# Altium schematic sheet OUTPUT SECTION.SchDoc
size A4; Organization: Altium Limited; Address1: L3, 12a Rodborough Rd; Address2: Frenchs Forest; Address3: NSW; Address4: Australia 2086
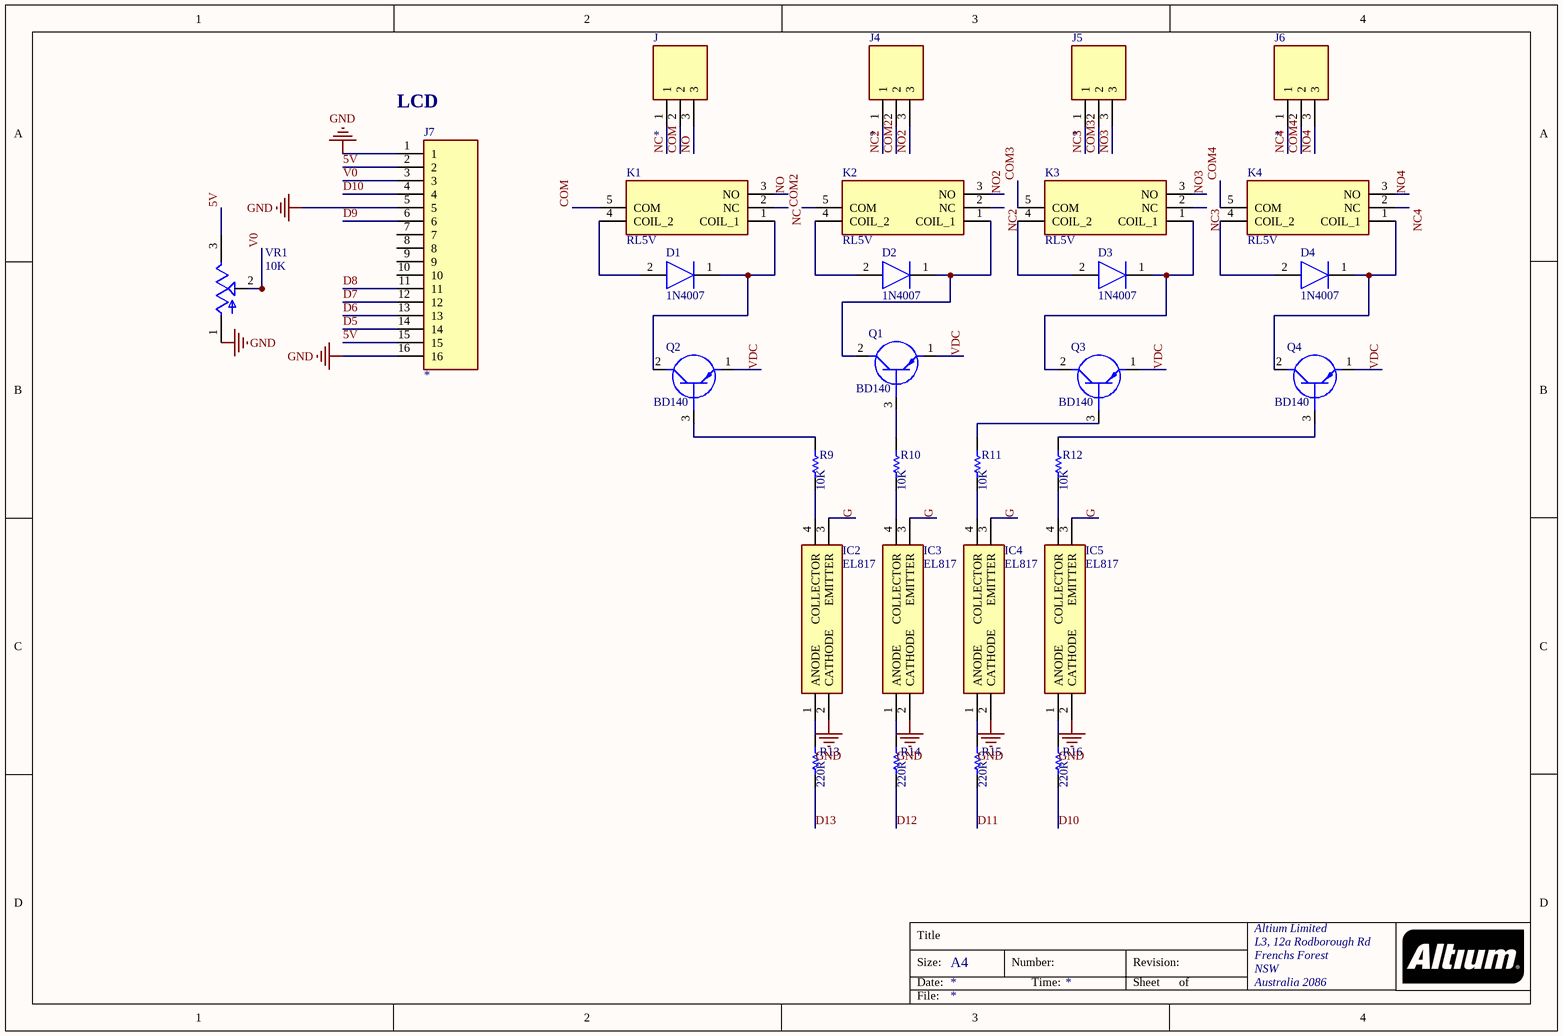
[diagram p0: OUTPUT SECTION.SchDoc]

## Parts
D1  1N4007  [DIOAD1138W56L406D183]
D2  1N4007  [DIOAD1138W56L406D183]
D3  1N4007  [DIOAD1138W56L406D183]
D4  1N4007  [DIOAD1138W56L406D183]
IC2  EL817  [DIP762W60P254L458H480Q4N]
IC3  EL817  [DIP762W60P254L458H480Q4N]
IC4  EL817  [DIP762W60P254L458H480Q4N]
IC5  EL817  [DIP762W60P254L458H480Q4N]
J  1776118-3  [TE_1776118-3]  (value not drawn)
J4  1776118-3  [TE_1776118-3]  (value not drawn)
J5  1776118-3  [TE_1776118-3]  (value not drawn)
J6  1776118-3  [TE_1776118-3]  (value not drawn)
J7  1-826646-6  [TE_1-826646-6]  (value not drawn)
K1  RL5V  [0476618]
K2  RL5V  [0476618]
K3  RL5V  [0476618]
K4  RL5V  [0476618]
Q1  BD140  [TO229P345X800X1460-3P]
Q2  BD140  [TO229P345X800X1460-3P]
Q3  BD140  [TO229P345X800X1460-3P]
Q4  BD140  [TO229P345X800X1460-3P]
R9  value 10K  [AXIAL-0.5]
R10  value 10K  [AXIAL-0.5]
R11  value 10K  [AXIAL-0.5]
R12  value 10K  [AXIAL-0.5]
R13  value 220R  [AXIAL-0.5]
R14  value 220R  [AXIAL-0.5]
R15  value 220R  [AXIAL-0.5]
R16  value 220R  [AXIAL-0.5]
VR1  10K  [TRIM_3362P-1-105]

## Nets
GND: IC2.2(CATHODE) IC3.2(CATHODE) IC4.2(CATHODE) IC5.2(CATHODE) J7.1 J7.5 J7.16 VR1.1(CCW)
5V: J7.2 J7.15 VR1.3(CW)
COM: J.2 K1.5(COM)
COM2: J4.2 K2.5(COM)
COM3: J5.2 K3.5(COM)
COM4: J6.2 K4.5(COM)
D5: J7.14
D6: J7.13
D7: J7.12
D8: J7.11
D9: J7.6
D10: J7.4 R16.1
D11: R15.1
D12: R14.1
D13: R13.1
G: IC2.3(EMITTER) IC3.3(EMITTER) IC4.3(EMITTER) IC5.3(EMITTER)
NC: J.1 K1.2(NC)
NC2: J4.1 K2.2(NC)
NC3: J5.1 K3.2(NC)
NC4: J6.1 K4.2(NC)
NO: J.3 K1.3(NO)
NO2: J4.3 K2.3(NO)
NO3: J5.3 K3.3(NO)
NO4: J6.3 K4.3(NO)
V0: J7.3 VR1.2(WIPER)
VDC: Q1.1(E) Q2.1(E) Q3.1(E) Q4.1(E)
NetD1_1: D1.1(K) K1.1(COIL_1) Q2.2(C)
NetD1_2: D1.2(A) K1.4(COIL_2)
NetD2_1: D2.1(K) K2.1(COIL_1) Q1.2(C)
NetD2_2: D2.2(A) K2.4(COIL_2)
NetD3_1: D3.1(K) K3.1(COIL_1) Q3.2(C)
NetD3_2: D3.2(A) K3.4(COIL_2)
NetD4_1: D4.1(K) K4.1(COIL_1) Q4.2(C)
NetD4_2: D4.2(A) K4.4(COIL_2)
NetIC2_1: IC2.1(ANODE) R13.2
NetIC2_4: IC2.4(COLLECTOR) R9.1
NetIC3_1: IC3.1(ANODE) R14.2
NetIC3_4: IC3.4(COLLECTOR) R10.1
NetIC4_1: IC4.1(ANODE) R15.2
NetIC4_4: IC4.4(COLLECTOR) R11.1
NetIC5_1: IC5.1(ANODE) R16.2
NetIC5_4: IC5.4(COLLECTOR) R12.1
NetQ1_3: Q1.3(B) R10.2
NetQ2_3: Q2.3(B) R9.2
NetQ3_3: Q3.3(B) R11.2
NetQ4_3: Q4.3(B) R12.2

Not connected (* = marked no-connect by the designer): J7 7 8 9 10

## Notes on the sheet
- (near J7) LCD
- Title
- Size:
- Date:
- A4
- Number:
- Time:
- Revision:
- Sheet
- of
- File:

## Library data of the parts
D1-D4 = 1N4678__DO35_: Diode; Manufacturer_Name: Microsemi Corporation; Manufacturer_Part_Number: 1N4678 (DO35); Datasheet Link: https://www.microsemi.com/document-portal/doc_download/5827-1n4678-4717-datasheet
IC2-IC5 = EL817: Integrated Circuit; Manufacturer_Name: Everlight; Datasheet Link: https://componentsearchengine.com/Datasheets/1/EL817.pdf; Height: 4.8mm; Manufacturer_Part_Number: EL817; Arrow Part Number: EL817; Arrow Price/Stock: https://www.arrow.com/en/products/el817/everlight-electronics; Mouser Part Number: 638-817; Mouser Price/Stock: https://www.mouser.co.uk/ProductDetail/Everlight/EL817?qs=vs%252BWWTB4QKYUQzCxB0orLQ%3D%3D
J J4-J6 = 1776118-3: Conn Terminal Block F 3 POS 5mm Solder ST Thru-Hole Package; Number_of_Positions: 3; Centerline_Pitch: 5 mm[.197 in]; MF: TE Connectivity; Value: *; MP: 1776118-3; SnapEDA_Link: https://www.snapeda.com/parts/1776118-3/TE%20Connectivity%20AMP%20Connectors/view-part/2375684/?ref=snap; Availability: Unavailable; Package: None; TE_purchase_URL: https://www.te.com/usa-en/product-1776118-3.html?te_bu=Cor&te_type=disp&te_campaign=seda_glo_cor-seda-global-disp-prtnr-fy19-seda-model-bom-cta_sma-317_1&elqCampaignId=32493; Price: None; EU_RoHS_Compliance: Compliant with Exemptions; Comment_1: *
J7 = 1-826646-6: Connector Header Through Hole 16 position 0.100 (2.54mm); MF: TE Connectivity; MP: 1-826646-6; Package: None; EU_RoHS_Compliance: Compliant; SnapEDA_Link: https://www.snapeda.com/parts/1-826646-6/TE%20Connectivity%20AMP%20Connectors/view-part/2412820/?ref=snap; Price: None; Availability: Warning; Value: *; Comment_1: *
K1-K4 = 0476618: Relay or Contactor; Manufacturer_Name: RS Components; Datasheet Link: https://docs-emea.rs-online.com/webdocs/1583/0900766b81583163.pdf; Height: 15mm; Manufacturer_Part_Number: 0476618
Q1-Q4 = BD14010STU: Transistor BJT PNP; Manufacturer_Name: ON Semiconductor; Datasheet Link: http://www.mouser.com/ds/2/149/BD140-888626.pdf; Height: 3.45mm; Manufacturer_Part_Number: BD14010STU; Mouser Part Number: 512-BD14010STU; Mouser Price/Stock: https://www.mouser.co.uk/ProductDetail/ON-Semiconductor-Fairchild/BD14010STU?qs=ljbEvF4DwOOnoRfj89Fh0g%3D%3D; Arrow Part Number: BD14010STU; Arrow Price/Stock: https://www.arrow.com/en/products/bd14010stu/on-semiconductor
R9-R16 = Res Semi: Semiconductor Resistor; Published: 8-Jun-2000; LatestRevisionDate: 17-Jul-2002; LatestRevisionNote: Re-released for DXP Platform.; PackageReference: AXIAL-0.5; Publisher: Altium Limited; PackageDescription: Axial Device, Thru-Hole; 2 Leads; 0.5 in Pin Spacing
VR1 = 3362P-1-105: 1 MOhms 0.5W, 1/2W PC Pins Through Hole Trimmer Potentiometer Cermet 1 Turn Top Adjustment; MF: Bourns; Value: *; Availability: Warning; SnapEDA_Link: https://www.snapeda.com/parts/3362P-1-105/Bourns/view-part/1463271/?ref=snap; Check_prices: https://www.snapeda.com/parts/3362P-1-105/Bourns/view-part/1463271/?ref=eda; Package: 3116 Bourns; Purchase-URL: https://pricing.snapeda.com/search/part/3362P-1-105/?ref=eda; MP: 3362P-1-105; Price: None